# Altium schematic sheet Medidor bateria.SchDoc
size A4
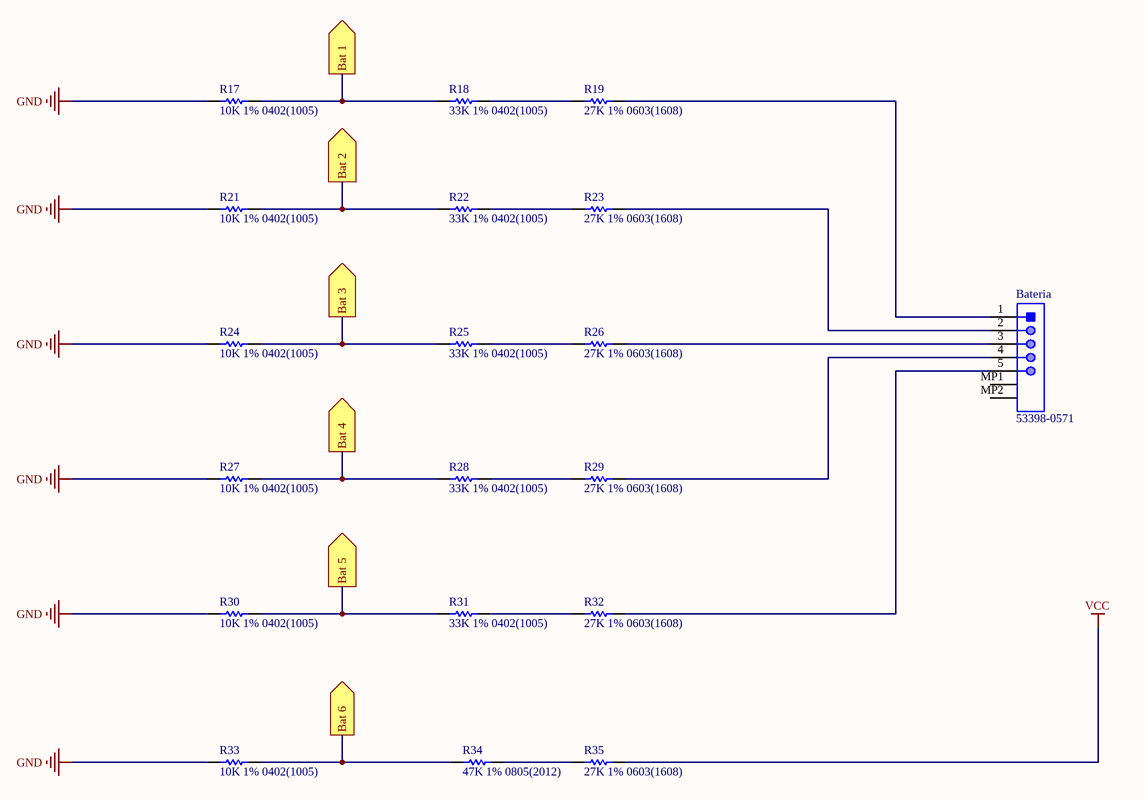
[diagram p0: Medidor bateria.SchDoc]

## Parts
Bateria  53398-0571  [MOLX-53398-0571-5_V]
R17  10K 1% 0402(1005)  [RESC0402(1005)_L]
R18  33K 1% 0402(1005)  [RESC0402(1005)_L]
R19  27K 1% 0603(1608)  [RESC0603(1608)_L]
R21  10K 1% 0402(1005)  [RESC0402(1005)_L]
R22  33K 1% 0402(1005)  [RESC0402(1005)_L]
R23  27K 1% 0603(1608)  [RESC0603(1608)_L]
R24  10K 1% 0402(1005)  [RESC0402(1005)_L]
R25  33K 1% 0402(1005)  [RESC0402(1005)_L]
R26  27K 1% 0603(1608)  [RESC0603(1608)_L]
R27  10K 1% 0402(1005)  [RESC0402(1005)_L]
R28  33K 1% 0402(1005)  [RESC0402(1005)_L]
R29  27K 1% 0603(1608)  [RESC0603(1608)_L]
R30  10K 1% 0402(1005)  [RESC0402(1005)_L]
R31  33K 1% 0402(1005)  [RESC0402(1005)_L]
R32  27K 1% 0603(1608)  [RESC0603(1608)_L]
R33  10K 1% 0402(1005)  [RESC0402(1005)_L]
R34  47K 1% 0805(2012)  [RESC0805(2012)_N]
R35  27K 1% 0603(1608)  [RESC0603(1608)_L]

## Ports
Bat 1 (out), Bat 2 (out), Bat 3 (out), Bat 4 (out), Bat 5 (out), Bat 6 (out)

## Nets
GND: R17.1 R21.1 R24.1 R27.1 R30.1 R33.1
VCC: R35.2
Bat 1: R17.2 R18.1 ; port Bat 1
Bat 2: R21.2 R22.1 ; port Bat 2
Bat 3: R24.2 R25.1 ; port Bat 3
Bat 4: R27.2 R28.1 ; port Bat 4
Bat 5: R30.2 R31.1 ; port Bat 5
Bat 6: R33.2 R34.1 ; port Bat 6
NetBateria_1: Bateria.1 R19.2
NetBateria_2: Bateria.2 R23.2
NetBateria_3: Bateria.3 R26.2
NetBateria_4: Bateria.4 R29.2
NetBateria_5: Bateria.5 R32.2
NetR18_2: R18.2 R19.1
NetR22_2: R22.2 R23.1
NetR25_2: R25.2 R26.1
NetR28_2: R28.2 R29.1
NetR31_2: R31.2 R32.1
NetR34_2: R34.2 R35.1

Not connected (* = marked no-connect by the designer): Bateria MP1 MP2

## Library data of the parts
Bateria = CMP-2000-05250-1: Male Header, Pitch 1.25 mm, 1 x 5 Postion, Height 4.7 mm, -40 to 85 degC, RoHS, Tape and Reel; Brand: Molex; Number of Positions: 5Position; Mounting Angle: Vertical; Current Rating: 1A; Pitch: 1.25mm; Voltage Rating: 125V; Type: Shrouded; Tradename: PicoBlade; Datasheet Version: Rev. E, 04/2006; Housing Material: Nylon; Datasheet URL: http://www.molex.com/pdm_docs/sd/533980571_sd.pdf; Termination Style: SMD; Contact Gender: Pin(Male); Factory Pack Quantity: 1000; Number of Rows: 1Row; Product: Headers; Package Reference: MOLX-53398-0571-5; Contact Material: PhosphorBronze; RoHS: Details; Manufacturer URL: http://www.molex.com/; Product Category: Headers&WireHousings; Contact Plating: Tin; Manufacturer: Molex; Series: 53398; Packaging: Reel; Mounting Style: SMD
R17 R21 R24 R27 R30 = CMP-1011-00623-1: 10K 0.063W 1% 0402 (1005 Metric)  SMD                                         71-CRCW040210K0FKEDC; Case-Metric: 1005; Value: 10000.00 Ohm; Case-EIA: 0402; Tolerance: 1 %; Technology: SMT; Power: 0.063 W
R18 R22 R25 R28 R31 = CMP-1011-00680-1: 33K 0.063W 1% 0402 (1005 Metric)  SMD                                 755-SFR01MZPF3302; Value: 33000.00 Ohm; Case-EIA: 0402; Case-Metric: 1005; Power: 0.063 W; Tolerance: 1 %; Technology: SMT
R19 R23 R26 R29 R32 = CMP-1012-00670-1: 27K 0.1W 1% 0603 (1608 Metric)  SMD                                      755-ESR03EZPF2702; Case-EIA: 0603; Case-Metric: 1608; Power: 0.250 W; Value: 27000.00 Ohm; Technology: SMT; Tolerance: 1 %
R33 = CMP-1011-00623-1: 10K 0.063W 1% 0402 (1005 Metric)  SMD                                   71-CRCW040210K0FKEDC; Case-Metric: 1005; Value: 10000.00 Ohm; Case-EIA: 0402; Tolerance: 1 %; Technology: SMT; Power: 0.063 W
R34 = CMP-1013-00699-1: 47K 0.125W 1% 0805 (2012 Metric)  SMD                               66-PCFW0805LF034702B; Case-Metric: 2012; Value: 47000.00 Ohm; Power: 0.100 W; Case-EIA: 0805; Tolerance: 1 %; Technology: SMT
R35 = CMP-1012-00670-1: 27K 0.1W 1% 0603 (1608 Metric)  SMD                                          755-ESR03EZPF2702; Case-EIA: 0603; Case-Metric: 1608; Power: 0.250 W; Value: 27000.00 Ohm; Technology: SMT; Tolerance: 1 %